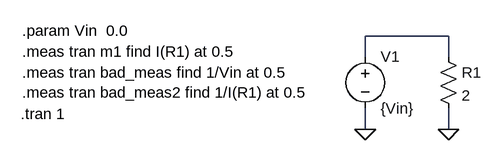
[diagram p0: schematic test10.asc]
test10.asc, the LTspice schematic file:
Version 4
SHEET 1 880 680
WIRE 480 48 352 48
WIRE 352 80 352 48
WIRE 480 80 480 48
WIRE 352 192 352 160
WIRE 480 192 480 160
FLAG 480 192 0
FLAG 352 192 0
SYMBOL voltage 352 64 R0
SYMATTR InstName V1
SYMATTR Value {Vin}
SYMBOL res 464 64 R0
SYMATTR InstName R1
SYMATTR Value 2
TEXT -176 40 Left 2 !.param Vin  0.0
TEXT -178 168 Left 2 !.tran 1
TEXT -176 72 Left 2 !.meas tran m1 find I(R1) at 0.5
TEXT -176 104 Left 2 !.meas tran bad_meas find 1/Vin at 0.5\n.meas tran bad_meas2 find 1/I(R1) at 0.5

The netlist it stands for:
* test10.asc
V1 N001 0 {Vin}
R1 N001 0 2
.param Vin  0.0
.tran 1
.meas tran m1 find I(R1) at 0.5
.meas tran bad_meas find 1/Vin at 0.5
.meas tran bad_meas2 find 1/I(R1) at 0.5
.backanno
.end